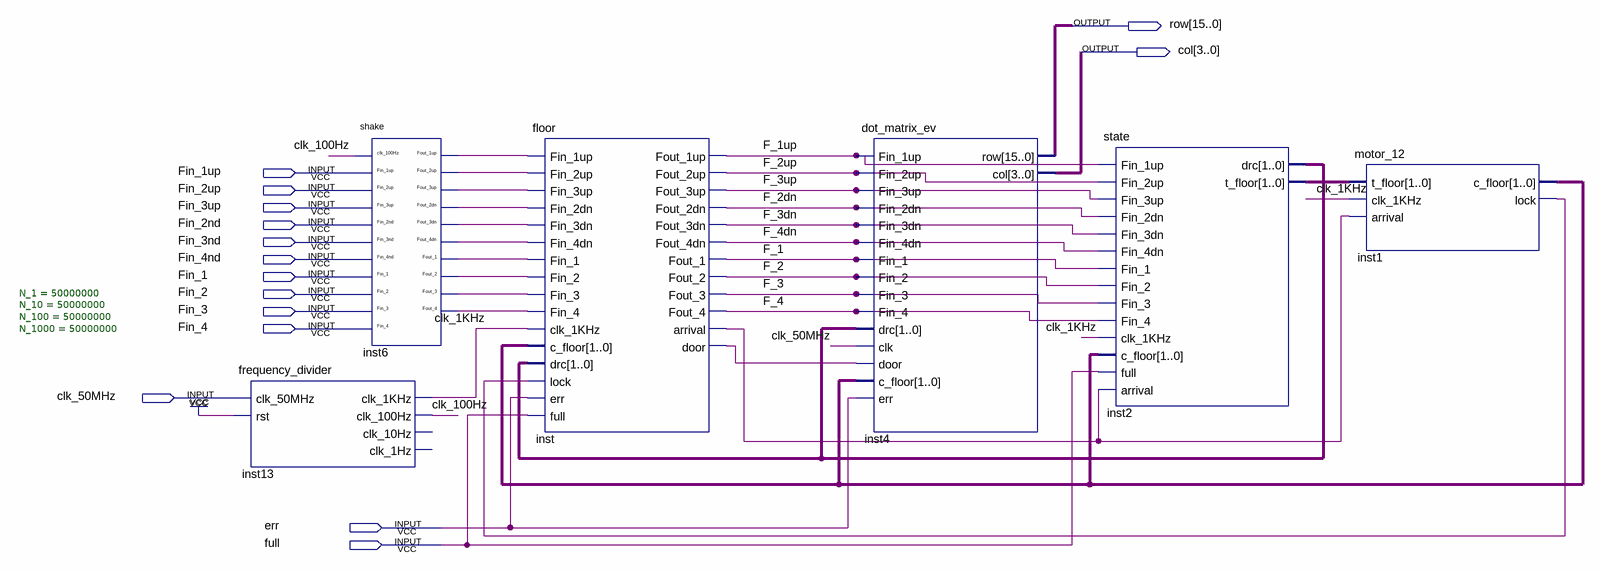
[diagram p0: schematic sheet]
// Quartus schematic project12.bdf as structural Verilog: 6 symbols, 15 pins
module project12 (
  input  Fin_1up,
  input  Fin_2up,
  input  Fin_3up,
  input  Fin_2nd,
  input  Fin_3nd,
  input  Fin_4nd,
  input  Fin_1,
  input  Fin_2,
  input  Fin_3,
  input  Fin_4,
  input  clk_50MHz,
  input  err,
  input  full,
  output [15:0] row,
  output [3:0] col
);

  wire clk_1KHz, clk_100Hz, F_1, F_1up, F_2, F_2dn, F_2up, F_3, F_3dn, F_3up, F_4, F_4dn, inst1_lock,
       inst6_fout_1, inst6_fout_1up, inst6_fout_2, inst6_fout_2dn, inst6_fout_2up, inst6_fout_3,
       inst6_fout_3dn, inst6_fout_3up, inst6_fout_4, inst6_fout_4dn, inst_arrival, inst_door;
  wire [1:0] inst1_c_floor, inst2_drc, inst2_t_floor;

  frequency_divider #(.N_1(50000000), .N_10(50000000), .N_100(50000000), .N_1000(50000000)) inst13 (
    .clk_50MHz(clk_50MHz), .rst(1'b1), .clk_1KHz(clk_1KHz), .clk_100Hz(clk_100Hz));  // open: clk_10Hz, clk_1Hz
  shake inst6 (
    .clk_100Hz(clk_100Hz), .Fin_1up(Fin_1up), .Fin_2up(Fin_2up), .Fin_3up(Fin_3up), .Fin_2nd(Fin_2nd),
    .Fin_3nd(Fin_3nd), .Fin_4nd(Fin_4nd), .Fin_1(Fin_1), .Fin_2(Fin_2), .Fin_3(Fin_3), .Fin_4(Fin_4),
    .Fout_1up(inst6_fout_1up), .Fout_2up(inst6_fout_2up), .Fout_3up(inst6_fout_3up),
    .Fout_2dn(inst6_fout_2dn), .Fout_3dn(inst6_fout_3dn), .Fout_4dn(inst6_fout_4dn), .Fout_1(inst6_fout_1),
    .Fout_2(inst6_fout_2), .Fout_3(inst6_fout_3), .Fout_4(inst6_fout_4));
  floor inst (
    .Fin_1up(inst6_fout_1up), .Fin_2up(inst6_fout_2up), .Fin_3up(inst6_fout_3up), .Fin_2dn(inst6_fout_2dn),
    .Fin_3dn(inst6_fout_3dn), .Fin_4dn(inst6_fout_4dn), .Fin_1(inst6_fout_1), .Fin_2(inst6_fout_2),
    .Fin_3(inst6_fout_3), .Fin_4(inst6_fout_4), .clk_1KHz(clk_1KHz), .c_floor(inst1_c_floor),
    .drc(inst2_drc), .lock(inst1_lock), .err(err), .full(full), .Fout_1up(F_1up), .Fout_2up(F_2up),
    .Fout_3up(F_3up), .Fout_2dn(F_2dn), .Fout_3dn(F_3dn), .Fout_4dn(F_4dn), .Fout_1(F_1), .Fout_2(F_2),
    .Fout_3(F_3), .Fout_4(F_4), .arrival(inst_arrival), .door(inst_door));
  dot_matrix_ev inst4 (
    .Fin_1up(F_1up), .Fin_2up(F_2up), .Fin_3up(F_3up), .Fin_2dn(F_2dn), .Fin_3dn(F_3dn), .Fin_4dn(F_4dn),
    .Fin_1(F_1), .Fin_2(F_2), .Fin_3(F_3), .Fin_4(F_4), .drc(inst2_drc), .clk(clk_50MHz), .door(inst_door),
    .c_floor(inst1_c_floor), .err(err), .row(row), .col(col));
  state inst2 (
    .Fin_1up(F_1up), .Fin_2up(F_2up), .Fin_3up(F_3up), .Fin_2dn(F_2dn), .Fin_3dn(F_3dn), .Fin_4dn(F_4dn),
    .Fin_1(F_1), .Fin_2(F_2), .Fin_3(F_3), .Fin_4(F_4), .clk_1KHz(clk_1KHz), .c_floor(inst1_c_floor),
    .full(full), .arrival(inst_arrival), .drc(inst2_drc), .t_floor(inst2_t_floor));
  motor_12 inst1 (
    .t_floor(inst2_t_floor), .clk_1KHz(clk_1KHz), .arrival(inst_arrival), .c_floor(inst1_c_floor),
    .lock(inst1_lock));
endmodule
